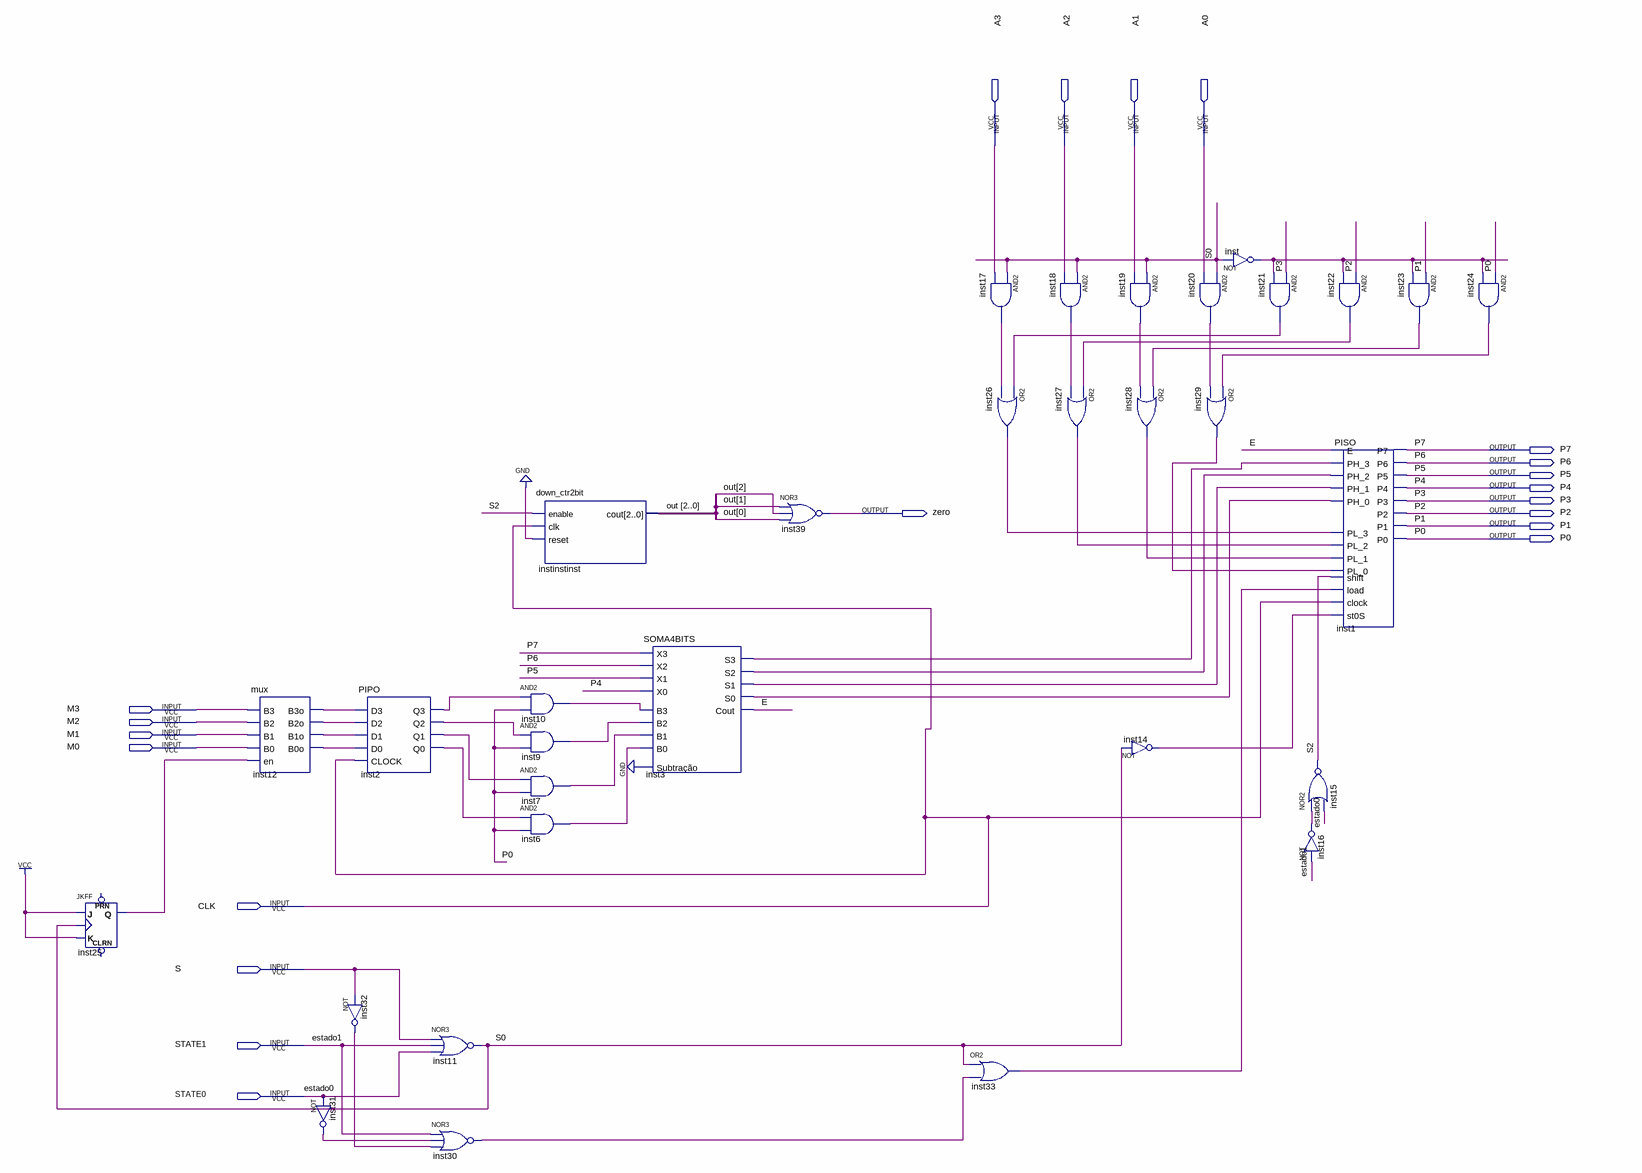
[diagram p0: schematic sheet]
// Quartus schematic datapath.bdf as structural Verilog: 32 symbols, 21 pins
module datapath (
  input  A3,
  input  A2,
  input  A1,
  input  A0,
  input  M3,
  input  M2,
  input  M1,
  input  M0,
  input  CLK,
  input  S,
  input  STATE1,
  input  STATE0,
  output P7,
  output P6,
  output P5,
  output P4,
  output P3,
  output zero,
  output P2,
  output P1,
  output P0
);

  wire E, inst2_q0, inst2_q1, inst2_q2, inst2_q3, inst3_s0, inst3_s1, inst3_s2, inst3_s3, inst6_out,
       inst7_out, inst9_out, inst10_out, inst12_b0o, inst12_b1o, inst12_b2o, inst12_b3o, inst14_out,
       inst16_out, inst17_out, inst18_out, inst19_out, inst20_out, inst21_out, inst22_out, inst23_out,
       inst24_out, inst25_q, inst26_out, inst27_out, inst28_out, inst29_out, inst30_out, inst31_out,
       inst32_out, inst33_out, inst_out, S0, S2;
  wire [2:0] out;

  JKFF inst25 (.K(1'b1), .J(1'b1), .CLK(S0), .Q(inst25_q));  // open: PRN, CLRN
  mux inst12 (
    .B3(M3), .B2(M2), .B1(M1), .B0(M0), .en(inst25_q), .B3o(inst12_b3o), .B2o(inst12_b2o), .B1o(inst12_b1o),
    .B0o(inst12_b0o));
  not inst31 (inst31_out, STATE0);
  PIPO inst2 (
    .D3(inst12_b3o), .D2(inst12_b2o), .CLOCK(CLK), .D1(inst12_b1o), .D0(inst12_b0o), .Q3(inst2_q3),
    .Q2(inst2_q2), .Q1(inst2_q1), .Q0(inst2_q0));
  not inst32 (inst32_out, S);
  nor inst11 (S0, S, STATE1, STATE0);
  nor inst30 (inst30_out, STATE1, inst31_out, inst32_out);
  and inst10 (inst10_out, inst2_q3, P0);
  and inst9 (inst9_out, inst2_q2, P0);
  and inst7 (inst7_out, inst2_q1, P0);
  and inst6 (inst6_out, inst2_q0, P0);
  down_ctr2bit instinstinst (.enable(S2), .clk(CLK), .reset(1'b0), .cout(out));
  SOMA4BITS inst3 (
    .X0(P4), .X1(P5), .X2(P6), .X3(P7), .B0(inst6_out), .B1(inst7_out), .B2(inst9_out), .B3(inst10_out),
    .\Subtração (1'b0), .S0(inst3_s0), .S1(inst3_s1), .S2(inst3_s2), .S3(inst3_s3), .Cout(E));
  nor inst39 (zero, out[1], out[2], out[0]);
  or inst33 (inst33_out, S0, inst30_out);
  and inst17 (inst17_out, S0, A3);
  or inst26 (inst26_out, inst21_out, inst17_out);
  and inst18 (inst18_out, S0, A2);
  or inst27 (inst27_out, inst22_out, inst18_out);
  and inst19 (inst19_out, S0, A1);
  or inst28 (inst28_out, inst23_out, inst19_out);
  not inst14 (inst14_out, S0);
  not inst (inst_out, S0);
  and inst20 (inst20_out, S0, A0);
  or inst29 (inst29_out, inst24_out, inst20_out);
  and inst21 (inst21_out, P3, inst_out);
  and inst22 (inst22_out, P2, inst_out);
  PISO inst1 (
    .PH_2(inst3_s2), .PH_1(inst3_s1), .PH_0(inst3_s0), .PL_3(inst26_out), .PL_2(inst27_out),
    .PL_1(inst28_out), .PL_0(inst29_out), .PH_3(inst3_s3), .load(inst33_out), .shift(S2), .E(E), .clock(CLK),
    .st0S(inst14_out), .P0(P0), .P1(P1), .P2(P2), .P3(P3), .P4(P4), .P5(P5), .P6(P6), .P7(P7));
  nor inst15 (S2, inst16_out, STATE0);
  not inst16 (inst16_out, STATE1);
  and inst23 (inst23_out, P1, inst_out);
  and inst24 (inst24_out, P0, inst_out);

  // Other names for the same wires on the sheet: estado0 = STATE0; estado1 = STATE1
endmodule
